# Altium schematic sheet AP_2.4G_5.0G.SchDoc
size A4
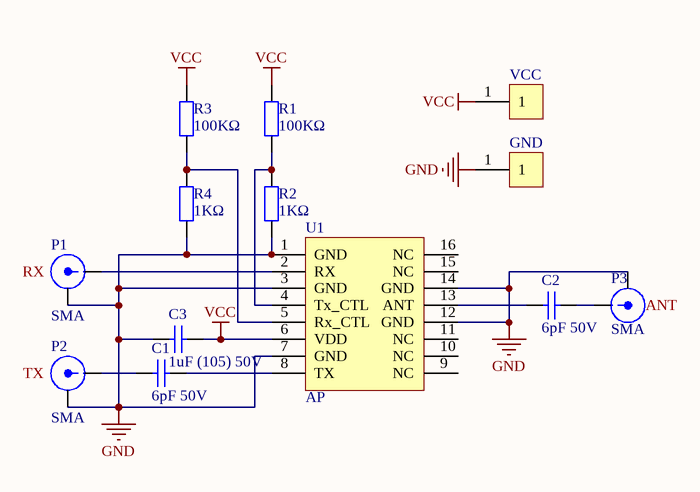
[diagram p0: AP_2.4G_5.0G.SchDoc]

## Parts
C1  6pF 50V  [0805_C]
C2  6pF 50V  [0805_C]
C3  1uF (105) 50V  [0805_C]
GND  SMDHDRX1  [SMDHDRX1]  (value not drawn)  (no BOM)
P1  SMA  [SMA-KE]
P2  SMA  [SMA-KE]
P3  SMA  [SMA-KE]
R1  100KΩ  [0805_R]
R2  1KΩ  [0805_R]
R3  100KΩ  [0805_R]
R4  1KΩ  [0805_R]
U1  AP  [QFN-16_3x3x05P]
VCC  SMDHDRX1  [SMDHDRX1]  (value not drawn)  (no BOM)

## Nets
GND: C3.2 GND.1 P1.2(Y) P2.2(Y) P3.2(Y) R2.1 R4.1 U1.1(GND) U1.3(GND) U1.7(GND) U1.12(GND) U1.14(GND)
VCC: C3.1 R1.2 R3.2 U1.6(VDD) VCC.1
NetC1_1: C1.1 P2.1(X)
NetC1_2: C1.2 U1.8(TX)
NetC2_1: C2.1 U1.13(ANT)
NetC2_2: C2.2 P3.1(X)
NetP1_1: P1.1(X) U1.2(RX)
NetR1_1: R1.1 R2.2 U1.4(Tx_CTL)
NetR3_1: R3.1 R4.2 U1.5(Rx_CTL)

Not connected (* = marked no-connect by the designer): U1 9(NC) 10(NC) 11(NC) 15(NC) 16(NC)

## Notes on the sheet
- (near P1) RX
- (near P3) ANT
- (near P2) TX

## Library data of the parts
C1 C2 = 0805 6pF (6R0) 0.25pF 50V: 贴片电容; ComponentLink1Description: 供应商链接; ComponentLink1URL: http://www.szlcsc.com/product/details_68656.html; Package: 0805; Supplier: LC; SuppliersPartNumber: C67560
C3 = 0805 1uF (105) 10% 50V: 贴片电容; ComponentLink1Description: 供应商链接; ComponentLink1URL: http://www.szlcsc.com/product/details_29074.html; Package: 0805; Supplier: LC; SuppliersPartNumber: C28323
GND VCC = SMDHDRX1: SMA and Hole
R1-R4 = 0805 1KΩ (1001) 1%: 贴片电阻; ComponentLink1Description: 供应商链接; ComponentLink1URL: http://www.szlcsc.com/product/details_18201.html; Package: 0805; Supplier: LC; SuppliersPartNumber: C17513
U1 = LS5601: AP_2.4G_5.0G